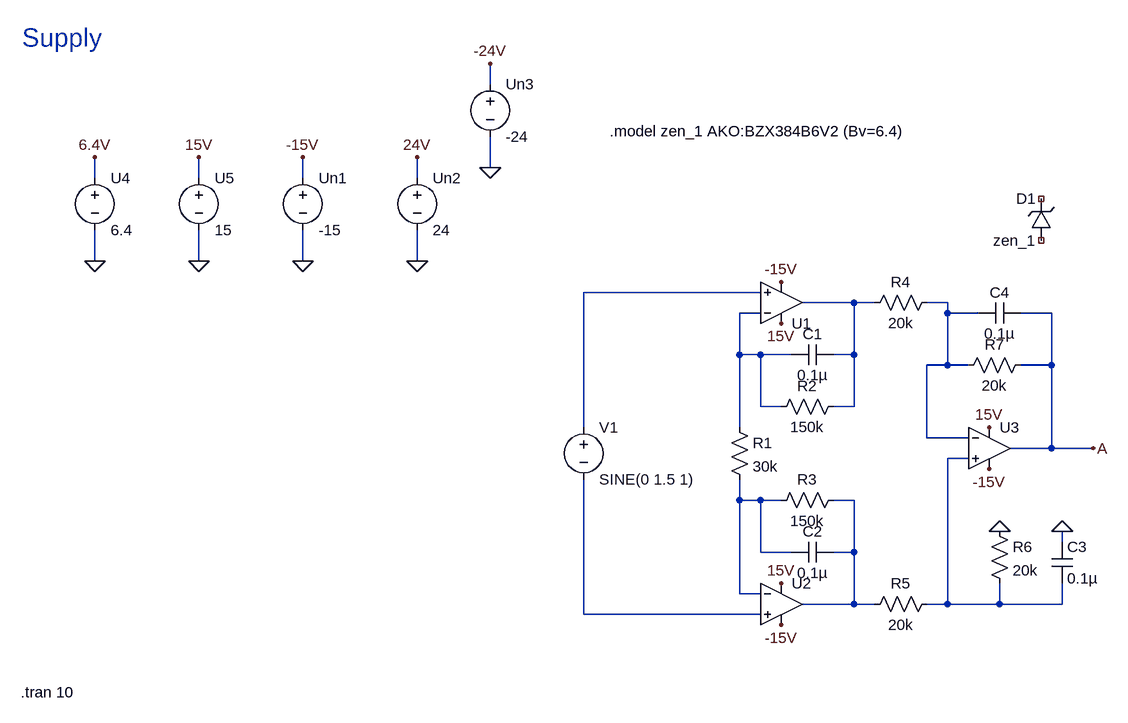
[diagram p0: schematic ia_clamp.asc]
ia_clamp.asc, the LTspice schematic file:
Version 4
SHEET 1 880 680
WIRE -368 -336 -368 -368
WIRE -368 -208 -368 -256
WIRE -976 -192 -976 -224
WIRE -816 -192 -816 -224
WIRE -656 -192 -656 -224
WIRE -480 -192 -480 -224
WIRE -976 -64 -976 -112
WIRE -816 -64 -816 -112
WIRE -656 -64 -656 -112
WIRE -480 -64 -480 -112
WIRE 48 -16 -224 -16
WIRE 192 0 112 0
WIRE 224 0 192 0
WIRE 336 0 304 0
WIRE 48 16 16 16
WIRE 336 16 336 0
WIRE 384 16 336 16
WIRE 496 16 448 16
WIRE 16 80 16 16
WIRE 48 80 16 80
WIRE 96 80 48 80
WIRE 192 80 192 0
WIRE 192 80 160 80
WIRE 336 96 336 16
WIRE 336 96 304 96
WIRE 368 96 336 96
WIRE 496 96 496 16
WIRE 496 96 448 96
WIRE 48 160 48 80
WIRE 80 160 48 160
WIRE 192 160 192 80
WIRE 192 160 160 160
WIRE -224 192 -224 -16
WIRE 16 192 16 80
WIRE 304 208 304 96
WIRE 368 208 304 208
WIRE 496 224 496 96
WIRE 496 224 432 224
WIRE 560 224 496 224
WIRE 368 240 336 240
WIRE 16 304 16 272
WIRE 48 304 16 304
WIRE 80 304 48 304
WIRE 192 304 160 304
WIRE 512 368 512 352
WIRE 48 384 48 304
WIRE 96 384 48 384
WIRE 192 384 192 304
WIRE 192 384 160 384
WIRE 16 448 16 304
WIRE 48 448 16 448
WIRE 192 464 192 384
WIRE 192 464 112 464
WIRE 224 464 192 464
WIRE 336 464 336 240
WIRE 336 464 304 464
WIRE 416 464 416 432
WIRE 416 464 336 464
WIRE 512 464 512 432
WIRE 512 464 416 464
WIRE -224 480 -224 272
WIRE 48 480 -224 480
FLAG 80 432 15V
FLAG 80 496 -15V
FLAG 560 224 A
FLAG 416 352 0
FLAG 512 352 0
FLAG 80 32 15V
FLAG 80 -32 -15V
FLAG 400 256 -15V
FLAG 400 192 15V
FLAG -976 -64 0
FLAG -976 -224 6.4V
FLAG -816 -64 0
FLAG -816 -224 15V
FLAG -656 -64 0
FLAG -656 -224 -15V
FLAG -480 -64 0
FLAG -480 -224 24V
FLAG -368 -208 0
FLAG -368 -368 -24V
SYMBOL res 0 176 R0
SYMATTR InstName R1
SYMATTR Value 30k
SYMBOL res 176 144 R90
WINDOW 0 0 56 VBottom 2
WINDOW 3 32 56 VTop 2
SYMATTR InstName R2
SYMATTR Value 150k
SYMBOL res 176 288 R90
WINDOW 0 0 56 VBottom 2
WINDOW 3 32 56 VTop 2
SYMATTR InstName R3
SYMATTR Value 150k
SYMBOL cap 160 64 R90
WINDOW 0 0 32 VBottom 2
WINDOW 3 32 32 VTop 2
SYMATTR InstName C1
SYMATTR Value 0.1µ
SYMBOL cap 160 368 R90
WINDOW 0 0 32 VBottom 2
WINDOW 3 32 32 VTop 2
SYMATTR InstName C2
SYMATTR Value 0.1µ
SYMBOL res 320 -16 R90
WINDOW 0 0 56 VBottom 2
WINDOW 3 32 56 VTop 2
SYMATTR InstName R4
SYMATTR Value 20k
SYMBOL res 320 448 R90
WINDOW 0 0 56 VBottom 2
WINDOW 3 32 56 VTop 2
SYMATTR InstName R5
SYMATTR Value 20k
SYMBOL res 400 336 R0
SYMATTR InstName R6
SYMATTR Value 20k
SYMBOL res 464 80 R90
WINDOW 0 0 56 VBottom 2
WINDOW 3 32 56 VTop 2
SYMATTR InstName R7
SYMATTR Value 20k
SYMBOL cap 496 368 R0
SYMATTR InstName C3
SYMATTR Value 0.1µ
SYMBOL cap 448 0 R90
WINDOW 0 0 32 VBottom 2
WINDOW 3 32 32 VTop 2
SYMATTR InstName C4
SYMATTR Value 0.1µ
SYMBOL Opamps\\UniversalOpamp2 80 0 M180
SYMATTR InstName U1
SYMATTR Value2 Avol=250k GBW=10Meg Slew=10Meg
SYMBOL Opamps\\UniversalOpamp2 80 464 R0
SYMATTR InstName U2
SYMATTR Value2 Avol=250k GBW=10Meg Slew=10Meg
SYMBOL Opamps\\UniversalOpamp2 400 224 R0
SYMATTR InstName U3
SYMATTR Value2 Avol=250k GBW=10Meg Slew=10Meg
SYMBOL voltage -976 -208 R0
WINDOW 123 0 0 Left 0
WINDOW 39 0 0 Left 0
SYMATTR InstName U4
SYMATTR Value 6.4
SYMBOL voltage -816 -208 R0
WINDOW 123 0 0 Left 0
WINDOW 39 0 0 Left 0
SYMATTR InstName U5
SYMATTR Value 15
SYMBOL voltage -656 -208 R0
WINDOW 123 0 0 Left 0
WINDOW 39 0 0 Left 0
SYMATTR InstName Un1
SYMATTR Value -15
SYMBOL voltage -480 -208 R0
WINDOW 123 0 0 Left 0
WINDOW 39 0 0 Left 0
SYMATTR InstName Un2
SYMATTR Value 24
SYMBOL voltage -368 -352 R0
WINDOW 123 0 0 Left 0
WINDOW 39 0 0 Left 0
SYMATTR InstName Un3
SYMATTR Value -24
SYMBOL voltage -224 176 R0
WINDOW 123 0 0 Left 0
WINDOW 39 0 0 Left 0
SYMATTR InstName V1
SYMATTR Value SINE(0 1.5 1)
SYMBOL zener 496 -96 R180
WINDOW 0 24 64 Left 2
WINDOW 3 24 0 Left 2
SYMATTR InstName D1
SYMATTR Value zen_1
TEXT -1088 -408 Left 4 ;Supply
TEXT -1090 600 Left 2 !.tran 10
TEXT -184 -264 Left 2 !.model zen_1 AKO:BZX384B6V2 (Bv=6.4)

The netlist it stands for:
* ia_clamp.asc
R1 N004 N006 30k
R2 N002 N004 150k
R3 N007 N006 150k
C1 N002 N004 0.1µ
C2 N007 N006 0.1µ
R4 N003 N002 20k
R5 N005 N007 20k
R6 0 N005 20k
R7 A N003 20k
C3 0 N005 0.1µ
C4 A N003 0.1µ
XU1 N001 N004 15V -15V N002 level.2 Avol=250k GBW=10Meg Slew=10Meg ilimit=25m rail=0 Vos=0 phimargin=45 en=0 enk=0 in=0 ink=0 Rin=500Meg  ; pins IN+ IN- V+ V- OUT
XU2 N008 N006 15V -15V N007 level.2 Avol=250k GBW=10Meg Slew=10Meg ilimit=25m rail=0 Vos=0 phimargin=45 en=0 enk=0 in=0 ink=0 Rin=500Meg  ; pins IN+ IN- V+ V- OUT
XU3 N005 N003 15V -15V A level.2 Avol=250k GBW=10Meg Slew=10Meg ilimit=25m rail=0 Vos=0 phimargin=45 en=0 enk=0 in=0 ink=0 Rin=500Meg  ; pins IN+ IN- V+ V- OUT
V§U4 6.4V 0 6.4
V§U5 15V 0 15
V§Un1 -15V 0 -15
V§Un2 24V 0 24
V§Un3 -24V 0 -24
V1 N001 N008 SINE(0 1.5 1)
D1 NC_01 NC_02 zen_1
.model D D
.lib standard.dio
* Supply
.tran 10
.model zen_1 AKO:BZX384B6V2 (Bv=6.4)
.lib UniversalOpamps2.sub
.backanno
.end